# EAGLE design counter2 (EAGLE 8.2.1)
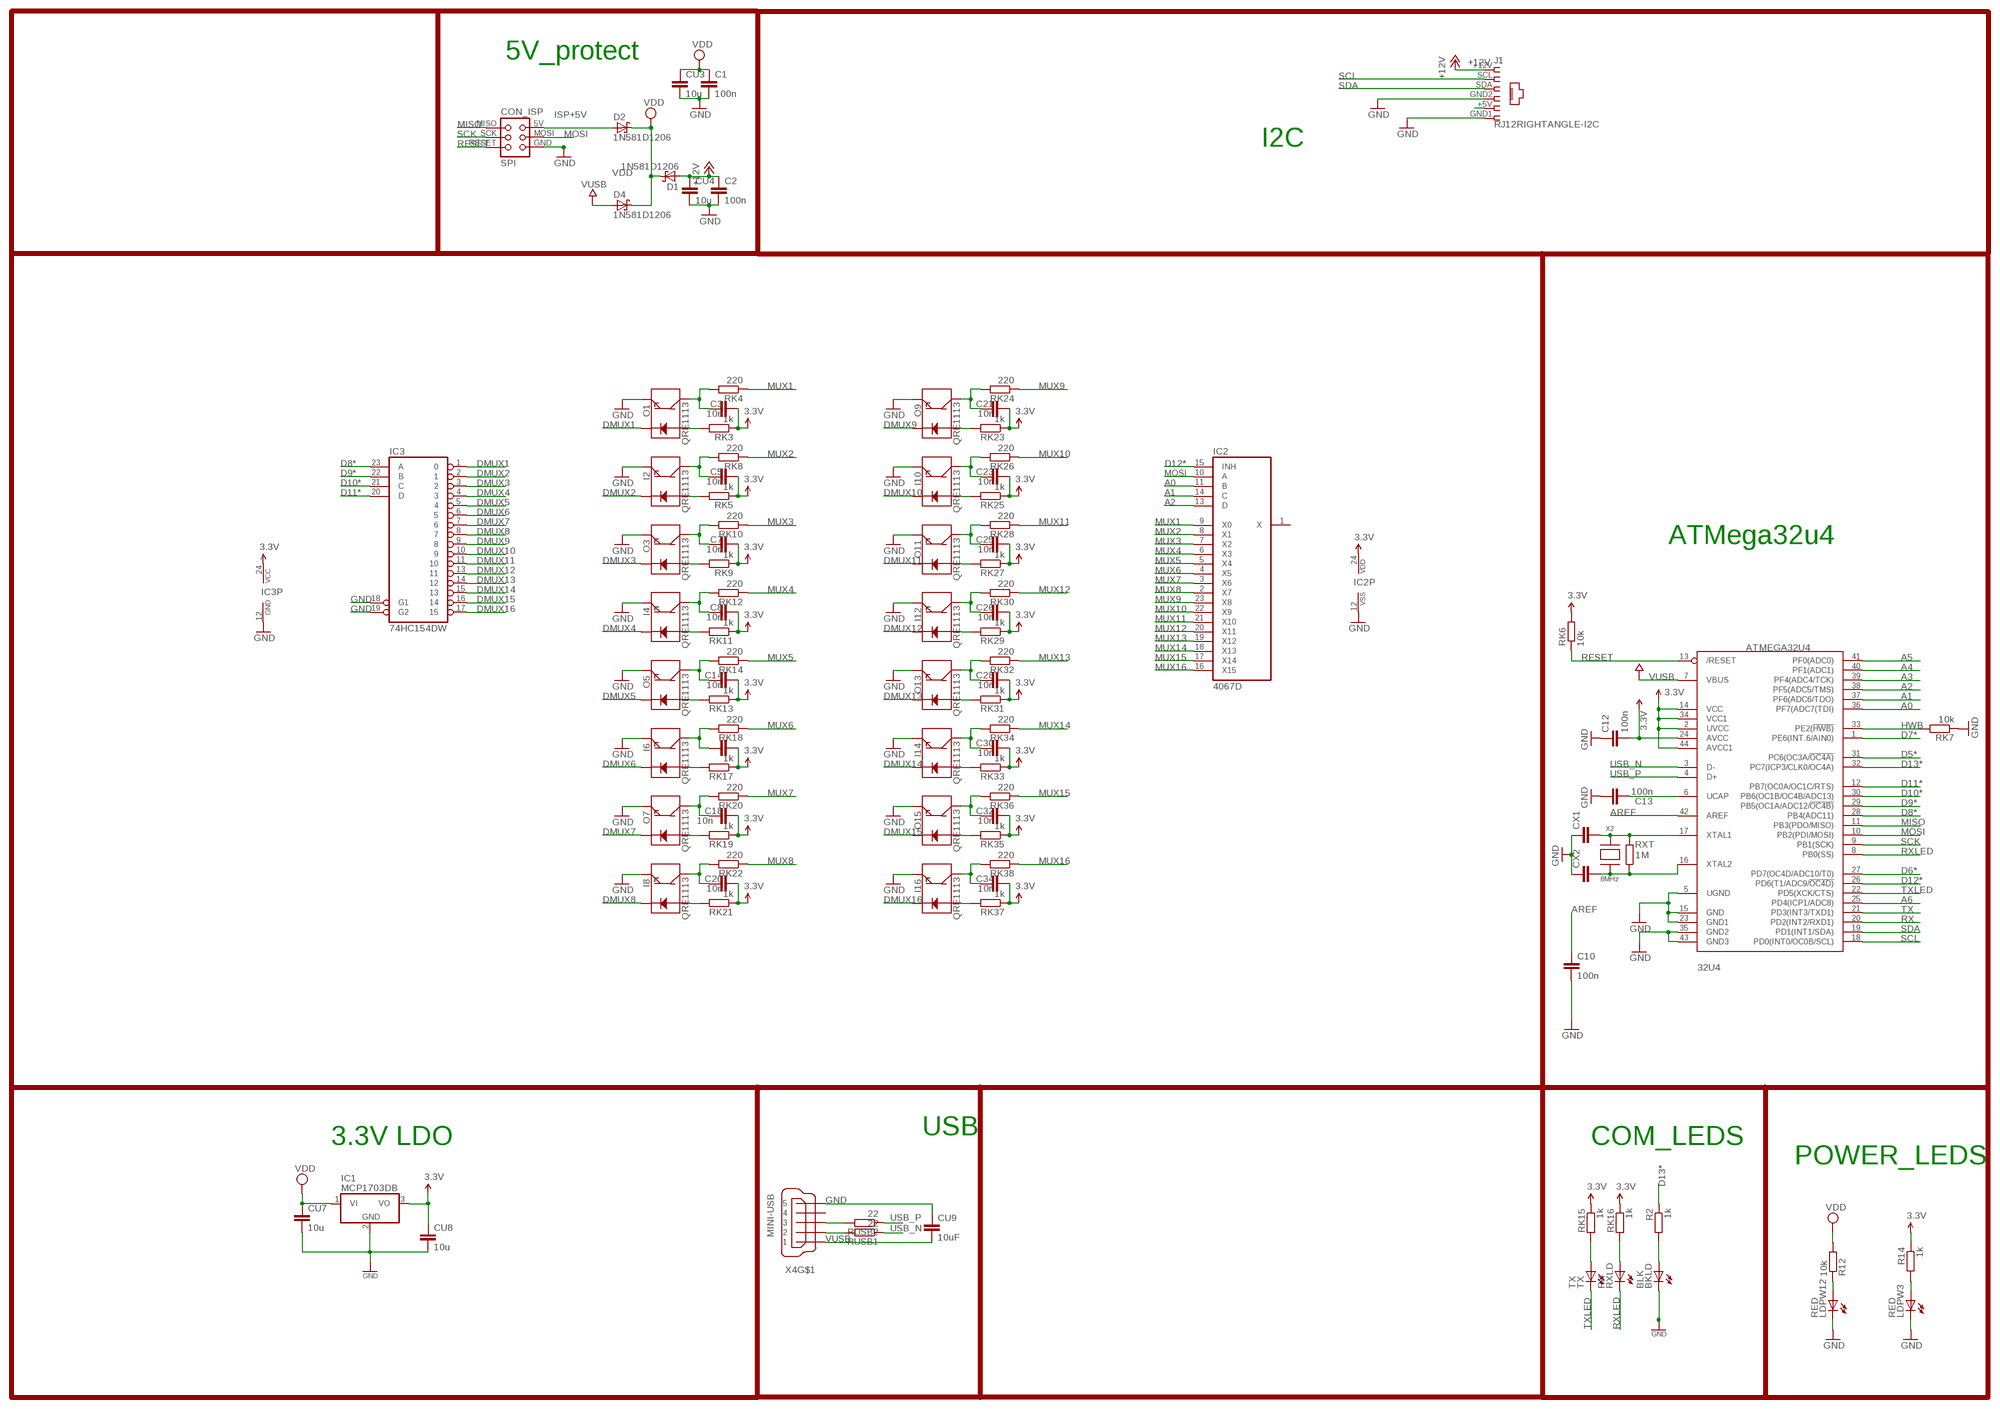
[diagram p0: schematic, sheet 1]

## Parts
32U4  ATMEGA32U4  ATMEGA32U4-AU  [TQFP44]
BKLD  BLK  LEDCHIP-LED0805  [CHIP-LED0805]
C1  100n  C-EUC0805  [C0805]
C2  100n  C-EUC0805  [C0805]
C3  10n  C-EUC0805  [C0805]
C5  10n  C-EUC0805  [C0805]
C7  10n  C-EUC0805  [C0805]
C8  10n  C-EUC0805  [C0805]
C10  100n  C-EUC0805  [C0805]
C12  100n  C-EUC0805  [C0805]
C13  100n  C-EUC0805  [C0805]
C14  10n  C-EUC0805  [C0805]
C15  10n  C-EUC0805  [C0805]
C18  10n  C-EUC0805  [C0805]
C20  10n  C-EUC0805  [C0805]
C21  10n  C-EUC0805  [C0805]
C23  10n  C-EUC0805  [C0805]
C25  10n  C-EUC0805  [C0805]
C26  10n  C-EUC0805  [C0805]
C28  10n  C-EUC0805  [C0805]
C30  10n  C-EUC0805  [C0805]
C32  10n  C-EUC0805  [C0805]
C34  10n  C-EUC0805  [C0805]
CON_ISP  SPI  TINYISPT  [TC2030-MCP-NL]
CU3  10u  C-EUC0805  [C0805]
CU4  10u  C-EUC0805  [C0805]
CU7  10u  C-EUC0805  [C0805]
CU8  10u  C-EUC0805  [C0805]
CU9  10uF  C-EUC0805  [C0805]
CX1  22pF  C-EUC0805  [C0805]
CX2  22pF  C-EUC0805  [C0805]
D1  1N581D1206  [LED-1206]
D2  1N581D1206  [LED-1206]
D4  1N581D1206  [LED-1206]
I2  QRE1113  [QRE1113]
I4  QRE1113  [QRE1113]
I6  QRE1113  [QRE1113]
I8  QRE1113  [QRE1113]
I10  QRE1113  [QRE1113]
I12  QRE1113  [QRE1113]
I14  QRE1113  [QRE1113]
I16  QRE1113  [QRE1113]
IC1  MCP1703DB  [SOT223]
IC2  4067D  [SO24W]
IC3  74HC154DW  [SO24W]
J1  RJ12RIGHTANGLE-I2C  [RJ12-RIGHTANGLE-I2C]
LDPW3  RED  LEDCHIP-LED0805  [CHIP-LED0805]
LDPW12  RED  LEDCHIP-LED0805  [CHIP-LED0805]
O1  QRE1113  [QRE1113]
O3  QRE1113  [QRE1113]
O5  QRE1113  [QRE1113]
O7  QRE1113  [QRE1113]
O9  QRE1113  [QRE1113]
O11  QRE1113  [QRE1113]
O13  QRE1113  [QRE1113]
O15  QRE1113  [QRE1113]
R2  1k  R-EU_R0805  [R0805]
R12  10k  R-EU_R0805  [R0805]
R14  1k  R-EU_R0805  [R0805]
RK3  1k  R-EU_M0805  [M0805]
RK4  220  R-EU_M0805  [M0805]
RK5  1k  R-EU_M0805  [M0805]
RK6  10k  R-EU_M0805  [M0805]
RK7  10k  R-EU_M0805  [M0805]
RK8  220  R-EU_M0805  [M0805]
RK9  1k  R-EU_M0805  [M0805]
RK10  220  R-EU_M0805  [M0805]
RK11  1k  R-EU_M0805  [M0805]
RK12  220  R-EU_M0805  [M0805]
RK13  1k  R-EU_M0805  [M0805]
RK14  220  R-EU_M0805  [M0805]
RK15  1k  R-EU_R0805  [R0805]
RK16  1k  R-EU_R0805  [R0805]
RK17  1k  R-EU_M0805  [M0805]
RK18  220  R-EU_M0805  [M0805]
RK19  1k  R-EU_M0805  [M0805]
RK20  220  R-EU_M0805  [M0805]
RK21  1k  R-EU_M0805  [M0805]
RK22  220  R-EU_M0805  [M0805]
RK23  1k  R-EU_M0805  [M0805]
RK24  220  R-EU_M0805  [M0805]
RK25  1k  R-EU_M0805  [M0805]
RK26  220  R-EU_M0805  [M0805]
RK27  1k  R-EU_M0805  [M0805]
RK28  220  R-EU_M0805  [M0805]
RK29  1k  R-EU_M0805  [M0805]
RK30  220  R-EU_M0805  [M0805]
RK31  1k  R-EU_M0805  [M0805]
RK32  220  R-EU_M0805  [M0805]
RK33  1k  R-EU_M0805  [M0805]
RK34  220  R-EU_M0805  [M0805]
RK35  1k  R-EU_M0805  [M0805]
RK36  220  R-EU_M0805  [M0805]
RK37  1k  R-EU_M0805  [M0805]
RK38  220  R-EU_M0805  [M0805]
RUSB1  22  R-EU_M0805  [M0805]
RUSB2  22  R-EU_M0805  [M0805]
RXLD  RX  LEDCHIP-LED0805  [CHIP-LED0805]
RXT  1M  R-EU_R0805  [R0805]
TX  TX  LEDCHIP-LED0805  [CHIP-LED0805]
X2  8MHz  XTALNX6035  [NX6035]
X4  MINI-USB  MINI-USB-SCHIELD-32005-201  [32005-201]

## Nets
3.3V [power]: 32U4.2(UVCC) 32U4.14(VCC) 32U4.24(AVCC) 32U4.34(VCC1) 32U4.44(AVCC1) C3.2 C5.2 C7.2 C8.2 C12.2 C14.2 C15.2 C18.2 C20.2 C21.2 C23.2 C25.2 C26.2 C28.2 C30.2 C32.2 C34.2 CU8.1 IC1.3(VO) IC2.24(VDD) IC3.24(VCC) R14.1 RK3.1 RK5.1 RK6.2 RK9.1 RK11.1 RK13.1 RK15.1 RK16.1 RK17.1 RK19.1 RK21.1 RK23.1 RK25.1 RK27.1 RK29.1 RK31.1 RK33.1 RK35.1 RK37.1
+5V: J1.+5V
+12V [power]: C2.1 CU4.1 D1.A J1.+12V
A0: 32U4.36(PF7(ADC7(TDI)) IC2.11(B)
A1: 32U4.37(PF6(ADC6/TDO)) IC2.14(C)
A2: 32U4.38(PF5(ADC5/TMS)) IC2.13(D)
A3: 32U4.39(PF4(ADC4/TCK))
A4: 32U4.40(PF1(ADC1))
A5: 32U4.41(PF0(ADC0))
A6: 32U4.25(PD4(ICP1/ADC8))
AREF: 32U4.42(AREF) C10.1
D5*: 32U4.31(PC6(OC3A/!OC4A))
D6*: 32U4.27(PD7(OC4D/ADC10/T0))
D7*: 32U4.1(PE6(INT.6/AIN0))
D8*: 32U4.28(PB4(ADC11)) IC3.23(A)
D9*: 32U4.29(PB5(OC1A/ADC12/!OC4B)) IC3.22(B)
D10*: 32U4.30(PB6(OC1B/OC4B/ADC13)) IC3.21(C)
D11*: 32U4.12(PB7(OC0A/OC1C/RTS)) IC3.20(D)
D12*: 32U4.26(PD6(T1/ADC9/!OC4D)) IC2.15(INH)
D13*: 32U4.32(PC7(ICP3/CLK0/OC4A)) R2.1
DMUX1: IC3.1 O1.2(K)
DMUX2: I2.2(K) IC3.2
DMUX3: IC3.3 O3.2(K)
DMUX4: I4.2(K) IC3.4
DMUX5: IC3.5 O5.2(K)
DMUX6: I6.2(K) IC3.6
DMUX7: IC3.7 O7.2(K)
DMUX8: I8.2(K) IC3.8
DMUX9: IC3.9 O9.2(K)
DMUX10: I10.2(K) IC3.10
DMUX11: IC3.11 O11.2(K)
DMUX12: I12.2(K) IC3.13
DMUX13: IC3.14 O13.2(K)
DMUX14: I14.2(K) IC3.15
DMUX15: IC3.16 O15.2(K)
DMUX16: I16.2(K) IC3.17
GND [power]: 32U4.5(UGND) 32U4.15(GND) 32U4.23(GND1) 32U4.35(GND2) 32U4.43(GND3) BKLD.C C1.2 C2.2 C10.2 C12.1 C13.1 CON_ISP.GND CU3.2 CU4.2 CU7.2 CU8.2 CU9.1 CX1.1 CX2.1 I2.4(E) I4.4(E) I6.4(E) I8.4(E) I10.4(E) I12.4(E) I14.4(E) I16.4(E) IC1.2(GND) IC2.12(VSS) IC3.12(GND) IC3.18(G1) IC3.19(G2) J1.GND1 J1.GND2 LDPW3.C LDPW12.C O1.4(E) O3.4(E) O5.4(E) O7.4(E) O9.4(E) O11.4(E) O13.4(E) O15.4(E) RK7.1 X4.5
HWB: 32U4.33(PE2(!HWB)) RK7.2
ISP+5V: CON_ISP.5V(VCC) D2.A
MISO: 32U4.11(PB3(PDO/MISO)) CON_ISP.MISO
MOSI: 32U4.10(PB2(PDI/MOSI)) CON_ISP.MOSI IC2.10(A)
MUX1: IC2.9(X0) RK4.1
MUX2: IC2.8(X1) RK8.1
MUX3: IC2.7(X2) RK10.1
MUX4: IC2.6(X3) RK12.1
MUX5: IC2.5(X4) RK14.1
MUX6: IC2.4(X5) RK18.1
MUX7: IC2.3(X6) RK20.1
MUX8: IC2.2(X7) RK22.1
MUX9: IC2.23(X8) RK24.1
MUX10: IC2.22(X9) RK26.1
MUX11: IC2.21(X10) RK28.1
MUX12: IC2.20(X11) RK30.1
MUX13: IC2.19(X12) RK32.1
MUX14: IC2.18(X13) RK34.1
MUX15: IC2.17(X14) RK36.1
MUX16: IC2.16(X15) RK38.1
N$1: 32U4.6(UCAP) C13.2
N$3: BKLD.A R2.2
N$7: LDPW12.A R12.1
N$18: RK15.2 TX.A
N$24: RK16.2 RXLD.A
N$34: LDPW3.A R14.2
N$42: 32U4.17(XTAL1) CX1.2 RXT.2 X2.P$2
RD1: O1.1(A) RK3.2
RD2: I2.1(A) RK5.2
RD3: O3.1(A) RK9.2
RD4: I4.1(A) RK11.2
RD5: O5.1(A) RK13.2
RD6: I6.1(A) RK17.2
RD7: O7.1(A) RK19.2
RD8: I8.1(A) RK21.2
RD9: O9.1(A) RK23.2
RD10: I10.1(A) RK25.2
RD11: O11.1(A) RK27.2
RD12: I12.1(A) RK29.2
RD13: O13.1(A) RK31.2
RD14: I14.1(A) RK33.2
RD15: O15.1(A) RK35.2
RD16: I16.1(A) RK37.2
RESET: 32U4.13(/RESET) CON_ISP.RESET RK6.1
RX: 32U4.20(PD2(INT2/RXD1))
RXLED: 32U4.8(PB0(SS)) RXLD.C
SCK: 32U4.9(PB1(SCK)) CON_ISP.SCK
SCL: 32U4.18(PD0(INT0/OC0B/SCL)) J1.SCL
SDA: 32U4.19(PD1(INT1/SDA)) J1.SDA
TX: 32U4.21(PD3(INT3/TXD1))
TXLED: 32U4.22(PD5(XCK/CTS)) TX.C
USB_N: 32U4.3(D-) RUSB1.1
USB_P: 32U4.4(D+) RUSB2.1
USBC_N: RUSB1.2 X4.2
USBC_P: RUSB2.2 X4.3
VDD [power]: C1.1 CU3.1 CU7.1 D1.C D2.C D4.C IC1.1(VI) R12.2
VUSB: 32U4.7(VBUS) CU9.2 D4.A X4.1
XTAL1: 32U4.16(XTAL2) CX2.2 RXT.1 X2.P$1
Y1: C3.1 O1.3(C) RK4.2
Y2: C5.1 I2.3(C) RK8.2
Y3: C7.1 O3.3(C) RK10.2
Y4: C8.1 I4.3(C) RK12.2
Y5: C14.1 O5.3(C) RK14.2
Y6: C15.1 I6.3(C) RK18.2
Y7: C18.1 O7.3(C) RK20.2
Y8: C20.1 I8.3(C) RK22.2
Y9: C21.1 O9.3(C) RK24.2
Y10: C23.1 I10.3(C) RK26.2
Y11: C25.1 O11.3(C) RK28.2
Y12: C26.1 I12.3(C) RK30.2
Y13: C28.1 O13.3(C) RK32.2
Y14: C30.1 I14.3(C) RK34.2
Y15: C32.1 O15.3(C) RK36.2
Y16: C34.1 I16.3(C) RK38.2
Unconnected: IC2.1(X) X4.4 X4.M1(S:S1) X4.M2(S:S2) X4.M3(S:S3) X4.M4(S:S4)

## Notes on the sheet
- 5V_protect
- I2C
- ATMega32u4
- USB
- 3.3V LDO | COM_LEDS
- POWER_LEDS

## Library data of the parts
32U4 = adafruit:ATMEGA32U4: http://www.ladyada.net/library/eagle
BKLD LDPW3 LDPW12 RXLD TX = adafruit:LED: LED OSRAM: - CHIPLED LG R971, LG N971, LY N971, LG Q971, LY Q971, LO R971, LY R971 LH N974, LH R974 LS Q976, LO Q976, LY Q976 LO Q996 - Hyper CHIPLED LW Q18S LB Q993, LB Q99A, LB R99A - SideLED LS A670, LO A670, LY A670, LG A670, LP A670 LB A673, LV A673, LT A673, LW A673 LH A674 LY A675 LS A676, LA A676, LO A676, LY A676, LW A676 LS A679, LY A679, LG A679 - Hyper Micro SIDELED® LS Y876, LA Y876, LO Y876, LY Y876 LT Y87S - SmartLED LW L88C, LW L88S LB L89C, LB L89S, LG L890 LS L89K, LO L89K, LY L89K LS L896, LA L896, LO L896, LY L896 - TOPLED LS T670, LO T670, LY T670, LG T670, LP T670 LSG T670, LSP T670, LSY T670, LOP T670, LYG T670 LG T671, LOG T671, LSG T671 LB T673, LV T673, LT T673, LW T673 LH T674 LS T676, LA T676, LO T676, LY T676, LB T676, LH T676, LSB T676, LW T676 LB T67C, LV T67C, LT T67C, LS T67K, LO T67K, LY T67K, LW E67C LS E67B, LA E67B, LO E67B, LY E67B, LB E67C, LV E67C, LT E67C LW T67C LS T679, LY T679, LG T679 LS T770, LO T770, LY T770, LG T770, LP T770 LB T773, LV T773, LT T773, LW T773 LH T774 LS E675, LA E675, LY E675, LS T675 LS T776, LA T776, LO T776, LY T776, LB T776 LHGB T686 LT T68C, LB T68C - Hyper Mini TOPLED® LB M676 - Mini TOPLED Santana® LG M470 LS M47K, LO M47K, LY M47K Source: http://www.osram.convergy.de/
C1-C3 C5 C7 C8 C10 C12-C15 C18 C20 C21 C23 C25 C26 C28 C30 C32 C34 CU3 CU4 CU7-CU9 CX1 CX2 = rcl:C-EU: CAPACITOR, European symbol
CON_ISP = lpatiny:TINYISP: CONNECTOR
D1 D2 D4 = lpatiny:1N581*: 1.0A SCHOTTKY BARRIER RECTIFIER Source: http://www.diodes.com/datasheets/ds23001.pdf
I2 I4 I6 I8 I10 I12 I14 I16 O1 O3 O5 O7 O9 O11 O13 O15 = SparkFun:QRE1113
IC1 = linear:MCP1703: 250 mA, 16V, Low Quiescent Current LDO Regulator Source: http://ww1.microchip.com/downloads/en/DeviceDoc/22049b.pdf
IC2 = 40xx:4067: 16-channel ANALOG MULTIPLEXER
IC3 = 74xx-eu:74*154: 4-line to 16-line data SELECTOR/MULTIPLEXER
J1 = lpatiny:RJ12: CORCOM Modular RJ Jacks No Shield Source: www.tycoelectronics.com .. ENG_DS_1654001_1099_RJ_L_0507.pdf
R2 R12 RK15 RK16 RXT = rcl:R-EU_: RESISTOR, European symbol
R14 RK3-RK14 RK17-RK38 RUSB1 RUSB2 = resistor:R-EU_: RESISTOR, European symbol
X2 = lpatiny:XTAL: Low cost SMT crystals, no capacitors included http://www.ladyada.net/library/eagle
X4 = con-cypressindustries:MINI-USB-SCHIELD-: MINI USB-B Conector Source: www.cypressindustries.com; OC_FARNELL: unknown; OC_NEWARK: unknown

## Net classes
0 default: width 0.203 mm, clearance 0.25 mm
1 power: width 0.203 mm, drill 0.305 mm, clearance 0.25 mm
2 VIN: width 0.254 mm, clearance 0.25 mm
3 fine: width 0.254 mm, clearance 0.25 mm
4 aref: width 0.254 mm, clearance 0.25 mm

## Board
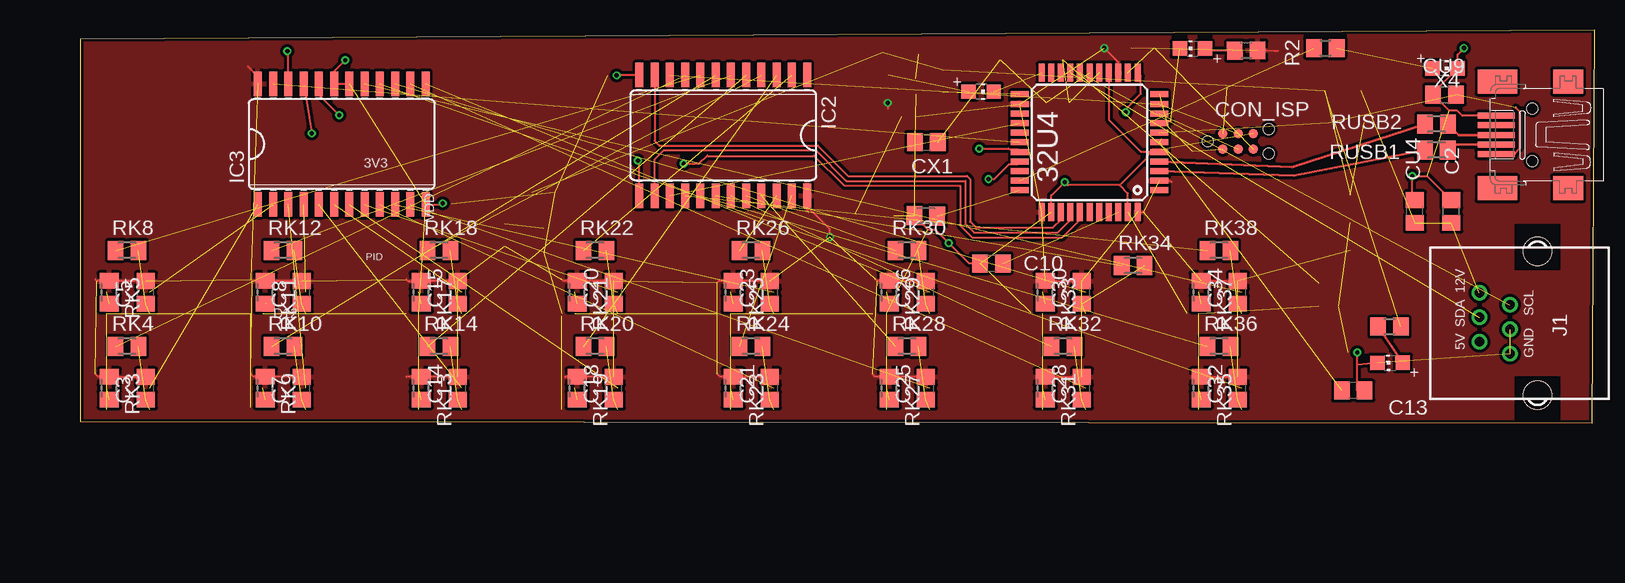
[diagram p1: board, top side]
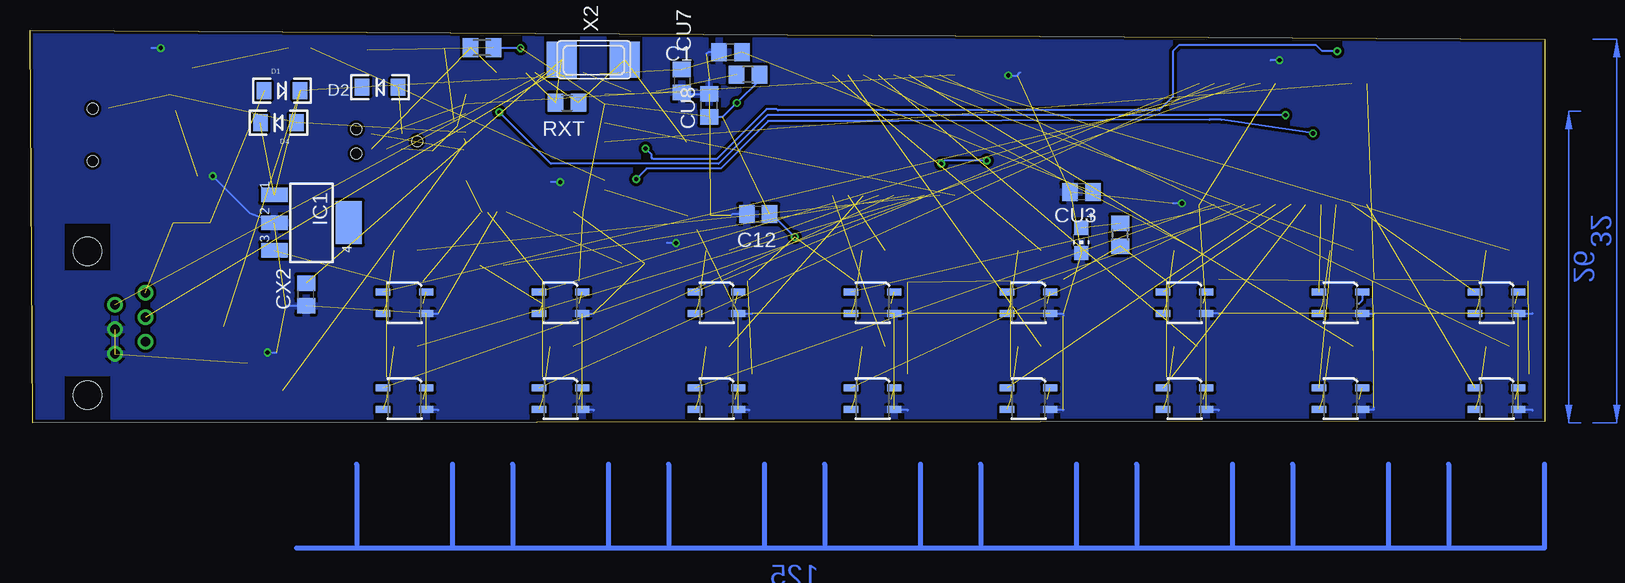
[diagram p2: board, bottom side, seen from below]

Size 126.22 x 32.75 mm. Coordinates in mm from the lower left corner, seen from the top.
Outline: 0,0.1 126,0 126.22,32.75 0,32 0,0.1
Copper layers (1*2*15*16): Top 0.035mm / dielectric 0.2mm / layer 2 0.0175mm / dielectric 1.1mm / layer 15 0.0175mm / dielectric 0.2mm / Bottom 0.035mm
Design rules "SeeedStudio_DRU_no_angle_20130527": minimum track width 6mil, minimum drill 12mil, track to track 6mil, track to pad 6mil, pad to pad 6mil, via to via 6mil, smd to smd 0mil, copper to edge 10mil, drill to drill 10mil, minimum pad ring 6mil, minimum via ring 6mil, stop-mask expansion 2mil, vias tented up to drill 25mil, thermal gap 10mil
Holes 3.2 mm at 37,46.21 58,49 51,49

### Footprints (pad centres in the part's own frame; a part is rotated, then mirrored left to right if it is on the bottom)
TQFP44 = smd 1.5 x 0.5: 1 -5.8,4; 2 -5.8,3.2; 3 -5.8,2.4; 4 -5.8,1.6; 5 -5.8,0.8; 6 -5.8,0; 7 -5.8,-0.8; 8 -5.8,-1.6; 9 -5.8,-2.4; 10 -5.8,-3.2; 11 -5.8,-4; 23 5.8,-4; 24 5.8,-3.2; 25 5.8,-2.4; 26 5.8,-1.6; 27 5.8,-0.8; 28 5.8,0; 29 5.8,0.8; 30 5.8,1.6; 31 5.8,2.4; 32 5.8,3.2; 33 5.8,4 | smd 0.5 x 1.5: 12 -4,-5.8; 13 -3.2,-5.8; 14 -2.4,-5.8; 15 -1.6,-5.8; 16 -0.8,-5.8; 17 0,-5.8; 18 0.8,-5.8; 19 1.6,-5.8; 20 2.4,-5.8; 21 3.2,-5.8; 22 4,-5.8; 34 4,5.8; 35 3.2,5.8; 36 2.4,5.8; 37 1.6,5.8; 38 0.8,5.8; 39 0,5.8; 40 -0.8,5.8; 41 -1.6,5.8; 42 -2.4,5.8; 43 -3.2,5.8; 44 -4,5.8
CHIP-LED0805 = smd 1.2 x 1.2: A 0,-1.05; C 0,1.05
C0805 = smd 1.3 x 1.5: 1 -0.95,0; 2 0.95,0
TC2030-MCP-NL = smd 0.787 x 0.787: 5V 1.27,0.635; GND 3.81,0.635; MISO 1.27,-0.635; MOSI 2.54,0.635; RESET 3.81,-0.635; SCK 2.54,-0.635 | hole 0.889: 0,0; 5.08,-1.016; 5.08,1.016
LED-1206 = smd 1.2 x 1.4: A -1.5,0; C 1.5,0
QRE1113 = smd 1.2 x 0.6: 1 -1.8,-0.9; 2 1.8,-0.9; 3 1.8,0.9; 4 -1.8,0.9
SOT223 = smd 1.219 x 2.235: 1 -2.311,-3.099; 2 0,-3.099; 3 2.311,-3.099 | smd 3.6 x 2.2: 4 0,3.099
SO24W = smd 0.66 x 2.032: 1 -6.985,-5.029; 2 -5.715,-5.029; 3 -4.445,-5.029; 4 -3.175,-5.029; 5 -1.905,-5.029; 6 -0.635,-5.029; 7 0.635,-5.029; 8 1.905,-5.029; 9 3.175,-5.029; 10 4.445,-5.029; 11 5.715,-5.029; 12 6.985,-5.029; 13 6.985,5.029; 14 5.715,5.029; 15 4.445,5.029; 16 3.175,5.029; 17 1.905,5.029; 18 0.635,5.029; 19 -0.635,5.029; 20 -1.905,5.029; 21 -3.175,5.029; 22 -4.445,5.029; 23 -5.715,5.029; 24 -6.985,5.029
RJ12-RIGHTANGLE-I2C = drill 0.8 pad 1.3: +5V -1.54,4.84; +12V 2.54,4.84; GND1 -2.54,2.3; GND2 -0.5,2.3; SCL 1.54,2.3; SDA 0.5,4.84 | hole 2.36: -6,0; 6,0
R0805 = smd 1.3 x 1.5: 1 -0.95,0; 2 0.95,0
M0805 = smd 1.3 x 1.6: 1 -0.95,0; 2 0.95,0
NX6035 = smd 2.5 x 3: P$1 2.665,0; P$2 -2.565,0
32005-201 = smd 3.1 x 0.5: 1 3,1.6; 2 3,0.8; 3 3,0; 4 3,-0.8; 5 3,-1.6 | smd 2.5 x 2: M1 -3,-4.45; M2 -3,4.45 | smd 3.3 x 2: M3 2.9,4.45; M4 2.9,-4.45 | hole 0.9: 0,2.2; 0,-2.2

### Placement (x,y rotation side)
32U4  84.12,23.38 180 top
BKLD  113.73,29.56 270 top
C1  67.84,30.91 180 bottom
C2  114.27,17.61 90 top
C3  5.48,2.86 90 top
C5  5.48,10.86 90 top
C7  18.48,2.86 90 top
C8  18.48,10.86 90 top
C10  75.94,13.28 180 top
C12  65.53,17.4 0 bottom
C13  106.09,2.68 180 top
C14  31.48,2.86 90 top
C15  31.48,10.86 90 top
C18  44.48,2.86 90 top
C20  44.48,10.86 90 top
C21  57.48,2.86 90 top
C23  57.48,10.86 90 top
C25  70.48,2.86 90 top
C26  70.48,10.86 90 top
C28  83.48,2.86 90 top
C30  83.48,10.86 90 top
C32  96.48,2.86 90 top
C34  96.48,10.86 90 top
CON_ISP  93.96,23.45 0 top
CU3  38.6,19.22 180 bottom
CU4  111.22,17.61 90 top
CU7  71.89,28.49 270 bottom
CU8  69.63,26.45 90 bottom
CU9  113.7,27.36 0 top
CX1  70.52,23.4 0 top
CX2  103.22,10.69 90 bottom
D1  105.22,27.68 0 bottom
D2  97.04,27.97 180 bottom
D4  105.51,25.02 180 bottom
I2  4,10 180 bottom
I4  17,10 180 bottom
I6  30,10 180 bottom
I8  43,10 180 bottom
I10  56,10 180 bottom
I12  69,10 180 bottom
I14  82,10 180 bottom
I16  95,10 180 bottom
IC1  102.75,16.68 270 bottom
IC2  53.59,23.96 180 top
IC3  21.8,23.23 0 top
J1  121.44,8.29 90 top
LDPW3  38.62,15.2 180 bottom
LDPW12  109.16,4.99 90.8 top
O1  4,2 180 bottom
O3  17,2 180 bottom
O5  30,2 180 bottom
O7  43,2 180 bottom
O9  56,2 180 bottom
O11  69,2 180 bottom
O13  82,2 180 bottom
O15  95,2 180 bottom
R2  103.77,31.24 0 top
R12  109.11,8.01 0 top
R14  35.37,15.67 90 bottom
RK3  2.43,2.87 270 top
RK4  3.91,6.37 0 top
RK5  2.43,10.87 270 top
RK6  88.56,31.26 0 bottom
RK7  70.47,17.25 359.3 top
RK8  3.91,14.37 0 top
RK9  15.43,2.87 270 top
RK10  16.91,6.37 0 top
RK11  15.43,10.87 270 top
RK12  16.91,14.37 0 top
RK13  28.43,2.87 270 top
RK14  29.91,6.37 0 top
RK15  66.39,29.04 180 bottom
RK16  97.17,31.04 180.6 top
RK17  28.43,10.87 270 top
RK18  29.91,14.37 0 top
RK19  41.43,2.87 270 top
RK20  42.91,6.37 0 top
RK21  41.43,10.87 270 top
RK22  42.91,14.37 0 top
RK23  54.43,2.87 270 top
RK24  55.91,6.37 0 top
RK25  54.43,10.87 270 top
RK26  55.91,14.37 0 top
RK27  67.43,2.87 270 top
RK28  68.91,6.37 0 top
RK29  67.43,10.87 270 top
RK30  68.91,14.37 0 top
RK31  80.43,2.87 270 top
RK32  81.91,6.37 0 top
RK33  80.43,10.87 270 top
RK34  87.75,13.1 0 top
RK35  93.43,2.87 270 top
RK36  94.91,6.37 0 top
RK37  93.43,10.87 270 top
RK38  94.91,14.37 0 top
RUSB1  113.02,22.73 0 top
RUSB2  113.03,24.89 0 top
RXLD  92.69,31.2 90 top
RXT  81.47,26.68 0 bottom
TX  75.09,27.6 270 top
X2  79.23,30.27 180 bottom
X4  121,24 180 top

### Tracks (layer width: path | path; a pad name or v marks a point on that pad's centre or on a via)
3.3V  (via drill 0.35)  (26 unrouted)
  Top 0.152: C3.2 2.44,3.81 RK3.1 1.51,3.82 1.27,4.06 | C5.2 5.48,11.82 RK5.1 1.38,11.82 1.27,11.94 | C8.2 18.48,11.82 RK11.1 14.34,11.82 14.22,11.94 | C7.2 18.48,3.82 RK9.1 14.46,3.82 14.22,4.06 | C14.2 31.48,3.82 RK13.1 27.19,3.82 27.18,3.81 | C15.2 31.48,11.82 RK17.1 27.29,11.82 27.18,11.94 | RK25.1 57.48,11.82 C23.2 | C21.2 57.48,3.82 RK23.1 53.33,3.82 53.09,4.06 | C25.2 70.48,3.82 RK27.1 66.28,3.82 66.04,4.06 | C26.2 70.48,11.82 RK29.1 66.41,11.82 66.29,11.94 | C20.2 44.48,11.82 RK21.1 40.25,11.82 40.13,11.94 | C18.2 44.48,3.82 RK19.1 40.4,3.82 40.39,3.81 | RK25.1 55.12,11.82 55.12,11.94 | RK33.1 83.48,11.82 C30.2 | RK31.1 83.48,3.82 C28.2 | RK35.1 96.48,3.82 C32.2 | RK37.1 96.48,11.82 C34.2 | IC3.24 14.82,28.87 13.97,29.72 | 60.58,18.03 IC2.24 | 60.58,18.03 60.58,17.65 60.71,17.53 | 32U4.44 88.59,17.58 88.65,17.53 | 32U4.2 90.81,20.18 90.93,20.07 | 32U4.14 86.52,30.07 v85.34,31.24 | v67.31,26.67 67.31,26.16 | v62.48,15.49 62.48,16.13 60.58,18.03 | RK16.1 99.55,31 99.82,30.99 | RK25.1 53.23,11.82 53.09,11.68
  Bottom 0.152: v85.34,31.24 87.59,31.24 RK6.2 | RK15.1 65.44,28.54 v67.31,26.67 68.48,25.5 CU8.1 | C12.2 64.39,17.4 v62.48,15.49
  pour Top: 0,32 126,33 126,0 0,0
+12V  (3 unrouted)
A0
  Top 0.152: IC2.11 47.88,23.5 48.26,23.11 61.47,23.11 64.01,20.57 73.91,20.57 74.17,20.32 74.17,16.76 74.68,16.26 81.05,16.26 81.75,16.95 81.75,17.61 32U4.36
A1
  Top 0.152: IC2.14 47.88,21.97 48.62,22.71 61.3,22.71 63.86,20.15 73.77,20.15 73.77,16.6 74.51,15.85 81.45,15.85 82.55,16.95 82.55,17.61 32U4.37
A2  (via drill 0.35)
  Top 0.152: IC2.13 46.61,21.72 v46.48,21.84 | v50.29,21.59 51.56,21.59 52.2,22.23 | 52.2,22.23 52.28,22.31 | 52.2,22.23 61.09,22.23 61.15,22.29 63.69,19.75 73.36,19.75 73.36,16.43 74.34,15.45 81.85,15.45 83.35,16.95 83.35,17.61 32U4.38
  Bottom 0.152: v46.48,21.84 50.04,21.84 v50.29,21.59
AREF  (1 unrouted)
D8*  (1 unrouted)
D9*  (via drill 0.35)
  Top 0.152: IC3.22 17.36,30.9 v17.27,30.99 | v74.93,22.86 77.38,22.86 77.43,22.81 78.1,22.81 32U4.29
  Bottom 0.152: v17.27,30.99 18.54,30.99 19.05,31.5 30.48,31.5 30.99,30.99 30.99,27.18 32.11,26.06 63.9,26.06 64.01,26.16 64.83,26.16 69,21.99 74.32,21.99 74.42,22.1 74.42,22.35 v74.93,22.86
D10*  (via drill 0.35)
  Top 0.152: IC3.21 v19.3,24.13 | 32U4.30 78.1,21.56 77.43,21.56 76.19,20.32 v75.69,20.32
  Bottom 0.152: v19.3,24.13 26.93,25.25 27.94,25.25 53.85,25.15 64.71,25.15 68.67,21.19 74.82,21.19 v75.69,20.32
D11*  (via drill 0.35)
  Top 0.152: IC3.20 19.9,27.35 v21.59,25.65 | v87.12,25.91 87.12,26.16 88.39,27.43 88.39,28.91 32U4.12
  Bottom 0.152: v21.59,25.65 64.77,25.65 68.83,21.59 82.8,21.59 v87.12,25.91
D12*  (1 unrouted)
D13*  (1 unrouted)
DMUX1  (1 unrouted)
DMUX2  (1 unrouted)
DMUX3  (1 unrouted)
DMUX4  (1 unrouted)
DMUX5  (1 unrouted)
DMUX6  (1 unrouted)
DMUX7  (1 unrouted)
DMUX8  (1 unrouted)
DMUX9  (1 unrouted)
DMUX10  (1 unrouted)
DMUX11  (1 unrouted)
DMUX12  (1 unrouted)
DMUX13  (1 unrouted)
DMUX14  (1 unrouted)
DMUX15  (1 unrouted)
DMUX16  (1 unrouted)
GND  (via drill 0.35)  (34 unrouted)
  Top 0.152: LDPW12.C 106.43,4.8 | 106.43,4.8 v106.43,5.84 | C13.1 106.43,2.68 106.43,4.8 | IC2.12 44.74,28.99 v44.7,28.96 | IC3.12 30.14,18.2 v30.23,18.29 | 32U4.35 80.92,18.94 v82.04,20.07 82.3,19.81 86.61,19.81 | 32U4.43 87.32,19.11 86.61,19.81 | 86.61,19.81 88.84,22.04 88.84,22.17 89.39,22.72 89.39,22.77 89.23,22.61 88.39,22.61 85.72,25.28 32U4.15 | C10.2 74.1,13.28 v72.39,14.99 71.27,16.11 70.62,16.12 70.43,16.31 70.43,16.34 RK7.1 | CU4.2 111,18.79 v111,20.57 112.26,20.57 C2.2 | X4.5 115.18,25.6 114.77,26.02 114.09,26.02 CU9.1 112.75,27.52 BKLD.C 114.78,30.71 v115.32,31.24 | IC3.18 IC3.19 21.17,29.3 v22.1,30.23
  Top 0.203: 89.39,22.77 90.07,22.77 32U4.5
  Bottom 0.152: O1.4 1.02,1.1 1.02,1.02 | I2.4 1.02,9.1 1.02,9.14 | I4.4 14.22,9.1 14.22,9.14 | O3.4 14.22,1.1 14.22,1.27 | I6.4 27.18,9.1 27.18,9.14 | O5.4 27.18,1.1 27.18,1.02 | O7.4 40.13,1.1 40.13,1.02 | I8.4 40.13,9.1 40.13,8.89 | I10.4 53.09,9.1 53.09,9.14 | O9.4 53.09,1.1 53.09,1.02 | O11.4 66.29,1.1 66.29,1.02 | I12.4 66.04,9.1 66.04,9.14 | I14.4 79.25,9.1 79.25,9.14 | O13.4 79.25,1.1 79.25,1.02 | O15.4 92.2,1.1 92.2,1.02 | I16.4 92.2,9.1 92.2,9.14 | CX2.1 104.9,9.73 104.9,9.65 | v106.43,5.84 105.66,5.84 | v44.7,28.96 43.94,28.96 43.69,29.21 | v30.23,18.29 30.99,18.29 | v82.04,20.07 82.8,20.07 | v72.39,14.99 73.15,14.99 | C12.1 67.69,17.4 67.82,17.27 | IC1.2 107.87,17.44 v111,20.57 | v115.32,31.24 116.08,31.24 | C1.2 69.68,30.91 69.85,30.73 | CU7.2 71.75,27.4 CU8.2 69.63,28.67 69.6,28.7 | v22.1,30.23 22.86,30.23
  pour Bottom: 0,32 126.22,32.75 126,0 0,0
HWB  (1 unrouted)
ISP+5V  (1 unrouted)
MISO  (3 unrouted)
MOSI  (2 unrouted)
MUX1  (1 unrouted)
MUX2  (1 unrouted)
MUX3  (1 unrouted)
MUX4  (1 unrouted)
MUX5  (1 unrouted)
MUX6  (1 unrouted)
MUX7  (1 unrouted)
MUX8  (1 unrouted)
MUX9  (1 unrouted)
MUX10  (1 unrouted)
MUX11  (1 unrouted)
MUX12  (1 unrouted)
MUX13  (1 unrouted)
MUX14  (1 unrouted)
MUX15  (1 unrouted)
MUX16  (1 unrouted)
N$1  (2 unrouted)
N$3  (1 unrouted)
N$7
  Top 0.152: LDPW12.A R12.1
N$13
  Bottom 0.406: 21,-10.46 13,-10.46 13,-3.46 | 21,-3.46 21,-10.46 | 21,-10.46 26,-10.46
N$18  (1 unrouted)
N$24
  Top 0.152: RK16.2 93.91,31.03 RXLD.A
N$34  (1 unrouted)
N$42  (3 unrouted)
N$73
  Bottom 0.406: 34,-10.46 26,-10.46 26,-3.46 | 34,-3.46 34,-10.46 | 34,-10.46 39,-10.46
N$74
  Bottom 0.406: 47,-10.46 39,-10.46 39,-3.46 | 47,-3.46 47,-10.46 | 47,-10.46 52,-10.46
N$75
  Bottom 0.406: 60,-10.46 52,-10.46 52,-3.46 | 60,-3.46 60,-10.46 | 60,-10.46 65,-10.46
N$76
  Bottom 0.406: 73,-10.46 65,-10.46 65,-3.46 | 73,-3.46 73,-10.46 | 73,-10.46 78,-10.46
N$77
  Bottom 0.406: 86,-10.46 78,-10.46 78,-3.46 | 86,-3.46 86,-10.46 | 86,-10.46 91,-10.46
N$78
  Bottom 0.406: 99,-10.46 91,-10.46 91,-3.46 | 99,-3.46 99,-10.46 | 99,-10.46 104,-10.46
N$83
  Bottom 0.406: 8,-10.46 0,-10.46 0,-3.46 | 8,-3.46 8,-10.46 | 8,-10.46 13,-10.46
RD1  (1 unrouted)
RD2  (1 unrouted)
RD3  (1 unrouted)
RD4  (1 unrouted)
  Bottom 0.152: I4.1 15.2,10.2 15.49,9.91
RD5  (1 unrouted)
RD6  (1 unrouted)
RD7  (1 unrouted)
RD8  (1 unrouted)
RD9  (1 unrouted)
RD10  (1 unrouted)
RD11  (1 unrouted)
RD12  (1 unrouted)
RD13  (1 unrouted)
RD14  (1 unrouted)
RD15  (1 unrouted)
RD16  (1 unrouted)
RESET  (2 unrouted)
RXLED  (1 unrouted)
  Top 0.203: 90.87,25.15 90.19,25.15 32U4.8
SCK  (1 unrouted)
SCL  (1 unrouted)
SDA  (1 unrouted)
TXLED  (1 unrouted)
USB_N
  Top 0.203: RUSB1.1 101.13,20.6 32U4.3
USB_P
  Top 0.203: RUSB2.1 101.02,21.3 32U4.4
USBC_N
  Top 0.203: X4.2 114.43,23.2 RUSB1.2
USBC_P
  Top 0.203: X4.3 114.87,24 RUSB2.2
VDD  (7 unrouted)
VUSB  (3 unrouted)
  Top 0.203: 119.64,26.29 119.98,25.95 119.98,22.89 119.53,22.43 118.06,22.43 X4.1
XTAL1  (3 unrouted)
Y1  (2 unrouted)
Y2  (2 unrouted)
Y3  (2 unrouted)
Y4  (2 unrouted)
Y5  (2 unrouted)
Y6  (2 unrouted)
Y7  (2 unrouted)
Y8  (2 unrouted)
Y9  (2 unrouted)
Y10  (2 unrouted)
Y11  (2 unrouted)
Y12  (2 unrouted)
Y13  (2 unrouted)
Y14  (2 unrouted)
Y15  (2 unrouted)
Y16  (2 unrouted)
(copper drawn outside any net)
  shapes: Bottom area x4

### Text on the board
tNames: SPI | D11 | MEM SELECT | Rx | IF LoRa | BLK | OPT | 3V3 | VDD | PID | D12
bNames: LoRa RN2483
tValues: Hive 1.0 | PID
203bmp: C:/Users/G/Pictures/logo_epfl.bmp